# Altium schematic sheet FTDI.SchDoc
size A4
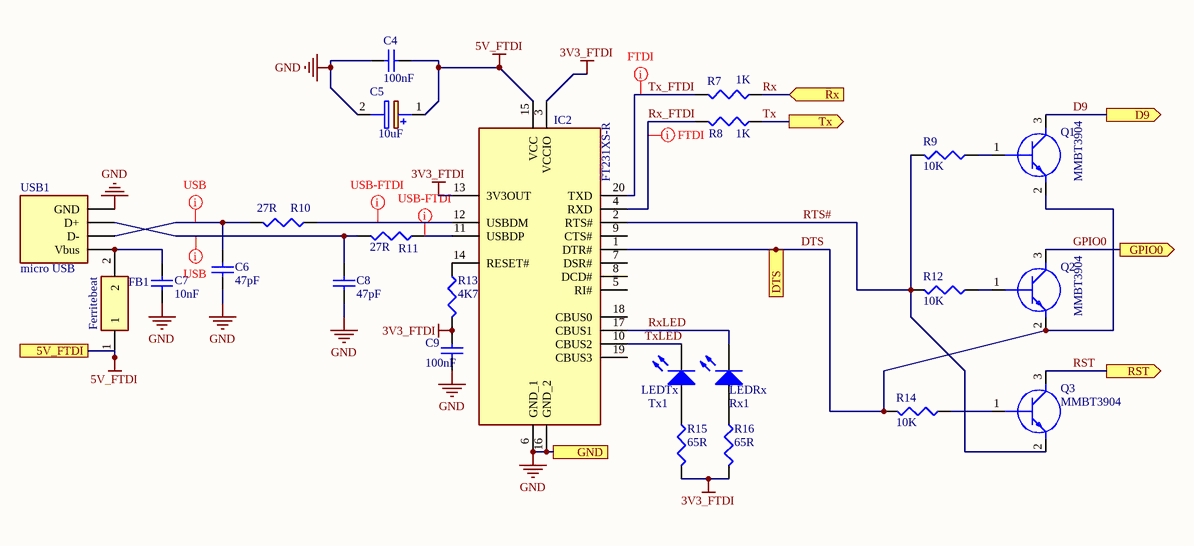
[diagram p0: FTDI.SchDoc]

## Parts
C4  100nF  [1608[0603]]
C5  10uF  [CAPPM3216X180N]
C6  47pF  [1608[0603]]
C7  10nF  [1608[0603]]
C8  47pF  [1608[0603]]
C9  100nF  [1608[0603]]
FB1  Ferritebeat  [BEADC1608X95N]
IC2  FT231XS-R  [SOP64P599X175-20N]
Q1  MMBT3904  [SOT95P230X110-3N]
Q2  MMBT3904  [SOT95P230X110-3N]
Q3  MMBT3904  [SOT95P230X110-3N]
R7  1K  [J1-0603]
R8  1K  [J1-0603]
R9  10K  [J1-0603]
R10  27R  [J1-0603]
R11  27R  [J1-0603]
R12  10K  [J1-0603]
R13  4K7  [J1-0603]
R14  10K  [J1-0603]
R15  65R  [J1-0603]
R16  65R  [J1-0603]
Rx1  LEDRx  [LED 0603]
Tx1  LEDTx  [LED 0603]
USB1  micro USB  [micro USB]

## Ports
5V_FTDI, D9 (out), DTS, GND, GPIO0 (out), RST (out), Rx (in), Tx (out)

## Nets
3V3_FTDI: C9.1 IC2.3(VCCIO) IC2.13(3V3OUT) R13.2 R15.2 R16.2
5V_FTDI: C4.2 C5.1(+) FB1.1 IC2.15(VCC) ; port 5V_FTDI
GND: C4.1 C5.2(-) C6.2 C7.1 C8.2 C9.2 IC2.6(GND_1) IC2.16(GND_2) USB1.5(GND) ; port GND
D9: Q1.3(C) ; port D9
DTS: IC2.1(DTR#) Q1.2(E) Q2.2(E) R14.2 ; port DTS
GPIO0: Q2.3(C) ; port GPIO0
RST: Q3.3(C) ; port RST
RTS#: IC2.2(RTS#) Q3.2(E) R9.2 R12.2
Rx: R7.1 ; port Rx
Rx_FTDI: IC2.4(RXD) R8.2
RxLED: IC2.17(CBUS1) Rx1.2(K)
Tx: R8.1 ; port Tx
Tx_FTDI: IC2.20(TXD) R7.2
TxLED: IC2.10(CBUS2) Tx1.2(K)
NetC6_1: C6.1 R10.2 USB1.2(D-)
NetC7_2: C7.2 FB1.2 USB1.1(Vbus)
NetC8_1: C8.1 R11.2 USB1.3(D+)
NetIC2_11: IC2.11(USBDP) R11.1
NetIC2_12: IC2.12(USBDM) R10.1
NetIC2_14: IC2.14(RESET#) R13.1
NetQ1_1: Q1.1(B) R9.1
NetQ2_1: Q2.1(B) R12.1
NetQ3_1: Q3.1(B) R14.1
NetR15_1: R15.1 Tx1.1(A)
NetR16_1: R16.1 Rx1.1(A)

Not connected (* = marked no-connect by the designer): IC2 5(RI#) 7(DSR#) 8(DCD#) 9(CTS#) 18(CBUS0) 19(CBUS3)

## Layout directives
net class USB: NetC6_1, NetC8_1
net class FTDI: Rx_FTDI, Tx_FTDI
net class USB-FTDI: NetIC2_11, NetIC2_12

## Library data of the parts
C4 C9 = Cap Semi: Capacitor (Semiconductor SIM Model); Value: 47pF; Published: 8-Jun-2000; LatestRevisionDate: 29-May-2009; LatestRevisionNote: IPC-7351 Footprint Added.; PackageReference: C1206; Publisher: Altium Limited; PackageDescription: Chip Capacitor
C5 = TAJA106K004RNJ: Capacitor Polarised; Manufacturer_Name: AVX; Datasheet Link: http://www.farnell.com/datasheets/1680476.pdf; Height: 1.8mm; Manufacturer_Part_Number: TAJA106K004RNJ; Mouser Part Number: 581-TAJA106K004R; Mouser Price/Stock: https://www.mouser.com/Search/Refine.aspx?Keyword=581-TAJA106K004R
C6-C8 = Cap Semi: Capacitor (Semiconductor SIM Model); Published: 8-Jun-2000; LatestRevisionDate: 29-May-2009; LatestRevisionNote: IPC-7351 Footprint Added.; PackageReference: C1206; Publisher: Altium Limited; PackageDescription: Chip Capacitor
  C6 C8: Value: 47pF
  C7: Value: 10nF
FB1 = BLM18DN151SH1D: Ferrite Bead; Manufacturer_Name: Murata Electronics; Datasheet Link: http://www.murata.com/~/media/webrenewal/support/library/catalog/products/emc/emifil/c31e.ashx?la=en-gb; Height: 0.95mm; Manufacturer_Part_Number: BLM18DN151SH1D; Mouser Part Number: 81-BLM18DN151SH1D; Mouser Price/Stock: https://www.mouser.com/Search/Refine.aspx?Keyword=81-BLM18DN151SH1D
IC2 = FT231XS-R: Integrated Circuit; Manufacturer_Name: FTDI Chip; Datasheet Link: http://docs-emea.rs-online.com/webdocs/1102/0900766b811020d3.pdf; Height: 1.753mm; Manufacturer_Part_Number: FT231XS-R; Mouser Part Number: 895-FT231XS-R; Mouser Price/Stock: https://www.mouser.co.uk/ProductDetail/FTDI/FT231XS-R?qs=Gp1Yz1mis3WduRPsgrTbtg%3D%3D; Arrow Part Number: FT231XS-R; Arrow Price/Stock: https://www.arrow.com/en/products/ft231xs-r/ftdi-chip
Q1-Q3 = MMBT3904,215: Transistor BJT NPN; Manufacturer_Name: Nexperia; Datasheet Link: http://assets.nexperia.com/documents/data-sheet/MMBT3904.pdf; Height: 1.1mm; Manufacturer_Part_Number: MMBT3904,215; Mouser Part Number: 771-MMBT3904T/R; Mouser Price/Stock: https://www.mouser.co.uk/ProductDetail/Nexperia/MMBT3904215?qs=LOCUfHb8d9s%2FW6hzAJGDbw%3D%3D; Arrow Part Number: MMBT3904,215; Arrow Price/Stock: https://www.arrow.com/en/products/mmbt3904215/nexperia?region=europe
R7-R16 = Res3: Resistor; Published: 8-Jun-2000; LatestRevisionDate: 29-May-2009; LatestRevisionNote: IPC-7351 Footprint Added.; PackageReference: J1-0603; Publisher: Altium Limited; PackageDescription: Chip Resistor
  R7 R8: Value: 1K
  R9 R12 R14: Value: 10K
  R10 R11: Value: 27R
  R13: Value: 4K7
  R15 R16: Value: 65R
Rx1 Tx1 = LED3: Typical BLUE SiC LED; Published: 8-Jun-2000; LatestRevisionDate: 17-Dec-2003; LatestRevisionNote: PCB Footprint replaced.; DatasheetVersion: 16-Apr-2002; PackageVersion: 16-Apr-2002; PackageReference: 3.5X2.8X1.9; Publisher: Altium Limited; PackageDescription: SM LED; 2 C-Bend Leads; Body 3.5 x 2.8 x 1.9 mm, inc leads (LxWxH typ)